# EAGLE design IMU_module (EAGLE 7.2.0)
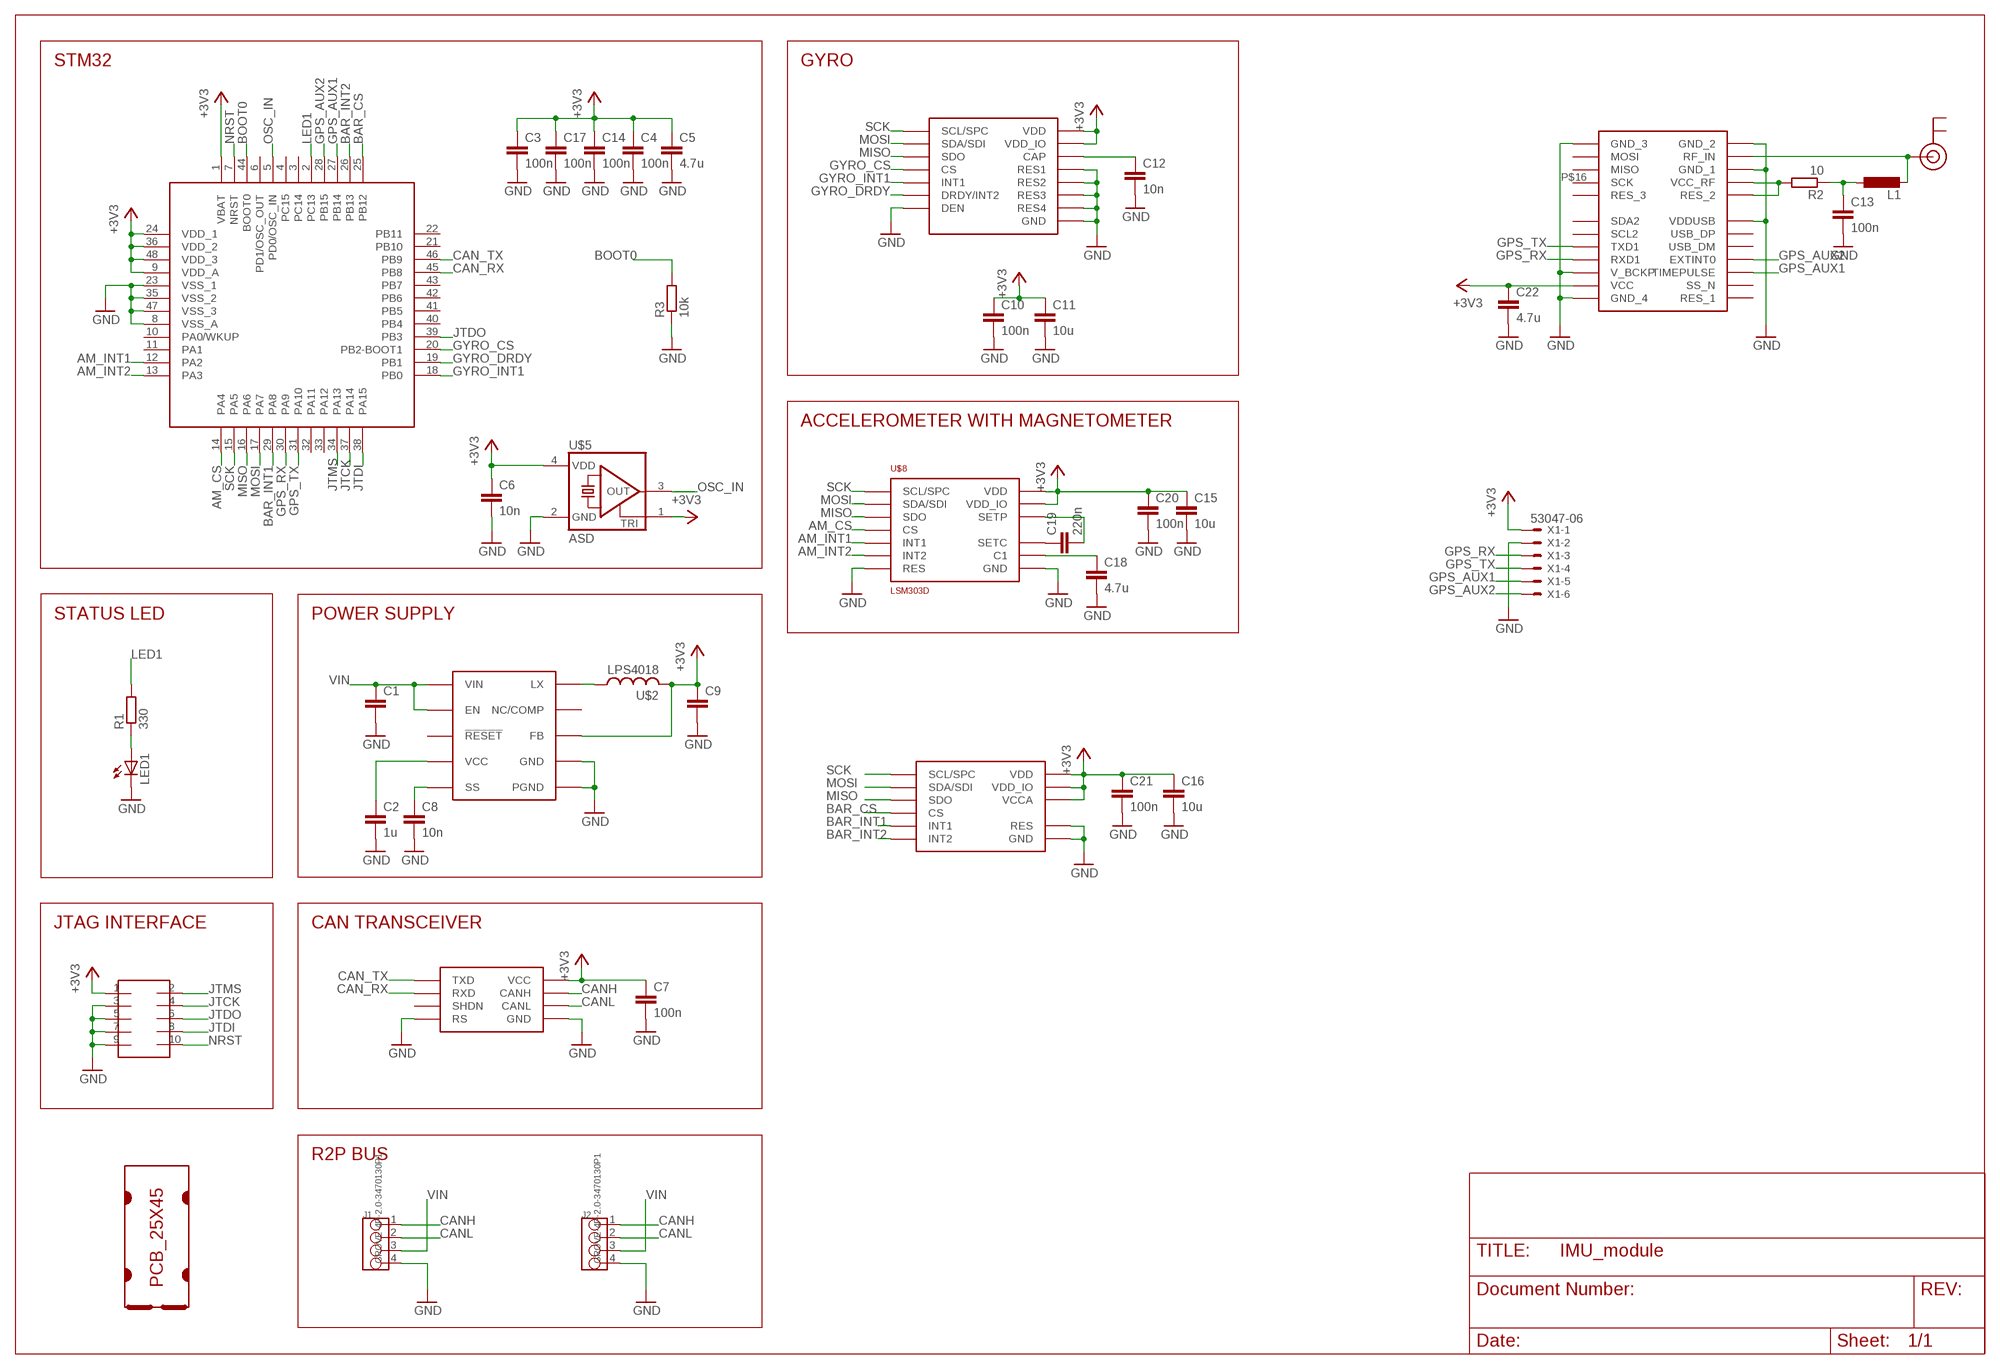
[diagram p0: schematic, sheet 1]

## Parts
C1  C-EUC1206  [C1206]
C2  1u  C-EUC0603  [C0603]
C3  100n  C-EUC0603  [C0603]
C4  100n  C-EUC0603  [C0603]
C5  4.7u  C-EUC0805  [C0805]
C6  10n  C-EUC0603  [C0603]
C7  100n  C-EUC0603  [C0603]
C8  10n  C-EUC0603  [C0603]
C9  C-EUC0805  [C0805]
C10  100n  C-EUC0603  [C0603]
C11  10u  C-EUC0805  [C0805]
C12  10n  C-EUC0603  [C0603]
C13  100n  C-EUC0603  [C0603]
C14  100n  C-EUC0603  [C0603]
C15  10u  C-EUC0805  [C0805]
C16  10u  C-EUC0805  [C0805]
C17  100n  C-EUC0603  [C0603]
C18  4.7u  C-EUC0805  [C0805]
C19  220n  C-EUC0603  [C0603]
C20  100n  C-EUC0603  [C0603]
C21  100n  C-EUC0603  [C0603]
C22  4.7u  C-EUC0805  [C0805]
J1  GROVE-4P-2.0-3470130P1  [4P-2.0]
J2  GROVE-4P-2.0-3470130P1  [4P-2.0]
L1  L-EUL2012C  [L2012C]
LED1  LEDCHIPLED_0805  [CHIPLED_0805]
R1  330  R-EU_R0603  [R0603]
R2  10  R-EU_R0603  [R0603]
R3  10k  R-EU_R0603  [R0603]
SOT1  MAX3051EKA  [SOT23-8L]
U$1  PCB_25X45  [25X45]
U$2  LPS4018  [LPS4018]
U$3  MAX17501  [TDFN-10]
U$4  FTSH-105TH  [FTSH-105-TH]
U$5  ASD  [2.5X2]
U$6  STM32F103CXTX  [LQFP48]
U$7  L3GD20H  [LGA16L]
U$8  LSM303D  [LGA16L]
U$9  LPS331AP  [LGA16L]
U$10  NEO-6  [NEO]
U$11  U.FL  [U.FL]
X1  53047-06  [53047-06]

## Nets
+3V3: C3.1 C4.1 C5.1 C6.1 C7.1 C9.1 C10.1 C11.1 C14.1 C15.1 C16.1 C17.1 C20.1 C21.1 C22.1 SOT1.3(VCC) U$2.P$2 U$3.P$5(FB) U$4.1 U$5.1(TRI) U$5.4(VDD) U$6.1(VBAT) U$6.9(VDD_A) U$6.24(VDD_1) U$6.36(VDD_2) U$6.48(VDD_3) U$7.P$1(VDD_IO) U$7.P$16(VDD) U$8.P$1(VDD_IO) U$8.P$14(VDD) U$9.P$1(VDD_IO) U$9.P$14(VDD) U$9.P$15(VCCA) U$10.P$23(VCC) X1.1
AM_CS: U$6.14(PA4) U$8.P$8(CS)
AM_INT1: U$6.12(PA2) U$8.P$11(INT1)
AM_INT2: U$6.13(PA3) U$8.P$9(INT2)
BAR_CS: U$6.25(PB12) U$9.P$8(CS)
BAR_INT1: U$6.29(PA8) U$9.P$11(INT1)
BAR_INT2: U$6.26(PB13) U$9.P$9(INT2)
BOOT0: R3.2 U$6.44(BOOT0)
CAN_RX: SOT1.4(RXD) U$6.45(PB8)
CAN_TX: SOT1.1(TXD) U$6.46(PB9)
CANH: J1.1 J2.1 SOT1.7(CANH)
CANL: J1.2 J2.2 SOT1.6(CANL)
GND: C1.2 C2.2 C3.2 C4.2 C5.2 C6.2 C7.2 C8.2 C9.2 C10.2 C11.2 C12.2 C13.2 C14.2 C15.2 C16.2 C17.2 C18.2 C20.2 C21.2 C22.2 J1.4 J2.4 LED1.C R3.1 SOT1.2(GND) SOT1.8(RS) U$3.P$1(PGND) U$3.P$9(GND) U$3.P$11(PGND) U$4.3 U$4.5 U$4.7 U$4.9 U$5.2(GND) U$6.8(VSS_A) U$6.23(VSS_1) U$6.35(VSS_2) U$6.47(VSS_3) U$7.P$8(DEN) U$7.P$9(RES1) U$7.P$10(RES2) U$7.P$11(RES3) U$7.P$12(GND) U$7.P$13(GND) U$7.P$15(RES4) U$8.P$5(GND) U$8.P$10(RES) U$8.P$12(GND) U$8.P$13(GND) U$8.P$16(GND) U$9.P$5(GND) U$9.P$10(RES) U$9.P$12(GND) U$9.P$13(GND) U$9.P$16(GND) U$10.P$7(VDDUSB) U$10.P$10(GND_1) U$10.P$12(GND_2) U$10.P$13(GND_3) U$10.P$22(V_BCKP) U$10.P$24(GND_4) X1.2
GPS_AUX1: U$6.27(PB14) U$10.P$3(TIMEPULSE) X1.5
GPS_AUX2: U$6.28(PB15) U$10.P$4(EXTINT0) X1.6
GPS_RX: U$6.30(PA9) U$10.P$21(RXD1) X1.3
GPS_TX: U$6.31(PA10) U$10.P$20(TXD1) X1.4
GYRO_CS: U$6.20(PB2-BOOT1) U$7.P$5(CS)
GYRO_DRDY: U$6.19(PB1) U$7.P$6(DRDY/INT2)
GYRO_INT1: U$6.18(PB0) U$7.P$7(INT1)
JTCK: U$4.4 U$6.37(PA14)
JTDI: U$4.8 U$6.38(PA15)
JTDO: U$4.6 U$6.39(PB3)
JTMS: U$4.2 U$6.34(PA13)
LED1: R1.2 U$6.2(PC13)
MISO: U$6.16(PA6) U$7.P$4(SDO) U$8.P$7(SDO) U$9.P$7(SDO)
MOSI: U$6.17(PA7) U$7.P$3(SDA/SDI) U$8.P$6(SDA/SDI) U$9.P$6(SDA/SDI)
N$1: U$2.P$1 U$3.P$10(LX)
N$3: C12.1 U$7.P$14(CAP)
N$4: LED1.A R1.1
N$5: C18.1 U$8.P$15(C1)
N$6: C19.1 U$8.P$2(SETC)
N$7: C2.1 U$3.P$4(VCC)
N$8: C8.1 U$3.P$6(SS)
N$9: C19.2 U$8.P$3(SETP)
N$10: L1.2 U$10.P$11(RF_IN) U$11.P$3(SIGNAL)
N$11: C13.1 L1.1 R2.1
N$12: R2.2 U$10.P$8(RES_2) U$10.P$9(VCC_RF)
NRST: U$4.10 U$6.7(NRST)
OSC_IN: U$5.3(OUT) U$6.5(PD0/OSC_IN)
SCK: U$6.15(PA5) U$7.P$2(SCL/SPC) U$8.P$4(SCL/SPC) U$9.P$4(SCL/SPC)
VIN: C1.1 J1.3 J2.3 U$3.P$2(VIN) U$3.P$3(EN)
Unconnected: SOT1.5(SHDN) U$3.P$7(NC/COMP) U$3.P$8(!RESET) U$6.3(PC14) U$6.4(PC15) U$6.6(PD1/OSC_OUT) U$6.10(PA0/WKUP) U$6.11(PA1) U$6.21(PB10) U$6.22(PB11) U$6.32(PA11) U$6.33(PA12) U$6.40(PB4) U$6.41(PB5) U$6.42(PB6) U$6.43(PB7) U$10.P$1(RES_1) U$10.P$2(SS_N) U$10.P$5(USB_DM) U$10.P$6(USB_DP) U$10.P$14(MOSI) U$10.P$15(MISO) U$10.P$16(SCK) U$10.P$17(RES_3) U$10.P$18(SDA2) U$10.P$19(SCL2) U$11.P$1(GND) U$11.P$2(GND)

## Notes on the sheet
- STM32 | GYRO
- ACCELEROMETER WITH MAGNETOMETER
- STATUS LED | POWER SUPPLY
- JTAG INTERFACE | CAN TRANSCEIVER
- R2P BUS

## Library data of the parts
C1-C22 = rcl:C-EU: CAPACITOR, European symbol
J1 J2 = OPL Eagle Library:GROVE-4P-2.0
L1 = rcl:L-EU: INDUCTOR, European symbol
LED1 = led:LED: LED OSRAM: - CHIPLED LG R971, LG N971, LY N971, LG Q971, LY Q971, LO R971, LY R971 LH N974, LH R974 LS Q976, LO Q976, LY Q976 LO Q996 - Hyper CHIPLED LW Q18S LB Q993, LB Q99A, LB R99A - SideLED LS A670, LO A670, LY A670, LG A670, LP A670 LB A673, LV A673, LT A673, LW A673 LH A674 LY A675 LS A676, LA A676, LO A676, LY A676, LW A676 LS A679, LY A679, LG A679 - Hyper Micro SIDELED® LS Y876, LA Y876, LO Y876, LY Y876 LT Y87S - SmartLED LW L88C, LW L88S LB L89C, LB L89S, LG L890 LS L89K, LO L89K, LY L89K LS L896, LA L896, LO L896, LY L896 - TOPLED LS T670, LO T670, LY T670, LG T670, LP T670 LSG T670, LSP T670, LSY T670, LOP T670, LYG T670 LG T671, LOG T671, LSG T671 LB T673, LV T673, LT T673, LW T673 LH T674 LS T676, LA T676, LO T676, LY T676, LB T676, LH T676, LSB T676, LW T676 LB T67C, LV T67C, LT T67C, LS T67K, LO T67K, LY T67K, LW E67C LS E67B, LA E67B, LO E67B, LY E67B, LB E67C, LV E67C, LT E67C LW T67C LS T679, LY T679, LG T679 LS T770, LO T770, LY T770, LG T770, LP T770 LB T773, LV T773, LT T773, LW T773 LH T774 LS E675, LA E675, LY E675, LS T675 LS T776, LA T776, LO T776, LY T776, LB T776 LHGB T686 LT T68C, LB T68C - Hyper Mini TOPLED® LB M676 - Mini TOPLED Santana® LG M470 LS M47K, LO M47K, LY M47K Source: http://www.osram.convergy.de LUXEON: - LUMILED® LXK2-PW12-R00, LXK2-PW12-S00, LXK2-PW14-U00, LXK2-PW14-V00 LXK2-PM12-R00, LXK2-PM12-S00, LXK2-PM14-U00 LXK2-PE12-Q00, LXK2-PE12-R00, LXK2-PE12-S00, LXK2-PE14-T00, LXK2-PE14-U00 LXK2-PB12-K00, LXK2-PB12-L00, LXK2-PB12-M00, LXK2-PB14-N00, LXK2-PB14-P00, LXK2-PB14-Q00 LXK2-PR12-L00, LXK2-PR12-M00, LXK2-PR14-Q00, LXK2-PR14-R00 LXK2-PD12-Q00, LXK2-PD12-R00, LXK2-PD12-S00 LXK2-PH12-R00, LXK2-PH12-S00 LXK2-PL12-P00, LXK2-PL12-Q00, LXK2-PL12-R00 Source: www.luxeon.com KINGBRIGHT: KA-3528ASYC Source: www.kingbright.com
R1-R3 = rcl:R-EU_: RESISTOR, European symbol
SOT1 = maxim:MAX3051
U$1 = r2p_pcb:PCB_25X45
U$2 = coilcraft:LPS4018
U$3 = maxim:MAX17501
U$4 = samtec:FTSH-105
U$5 = abracon:ASD
U$6 = st:STM32F103CX
U$7 = st:L3GD20H
U$8 = st:LSM303D
U$9 = st:LPS331AP
U$10 = u-blox:NEO-6
U$11 = SparkFun:U.FL
X1 = con-molex:53?-06: CONNECTOR wire to board 1.25 mm (.049 inch) pitch header; MPN: 53047-0610-C; OC_FARNELL: 9733078; OC_NEWARK: 03M2965

## Board
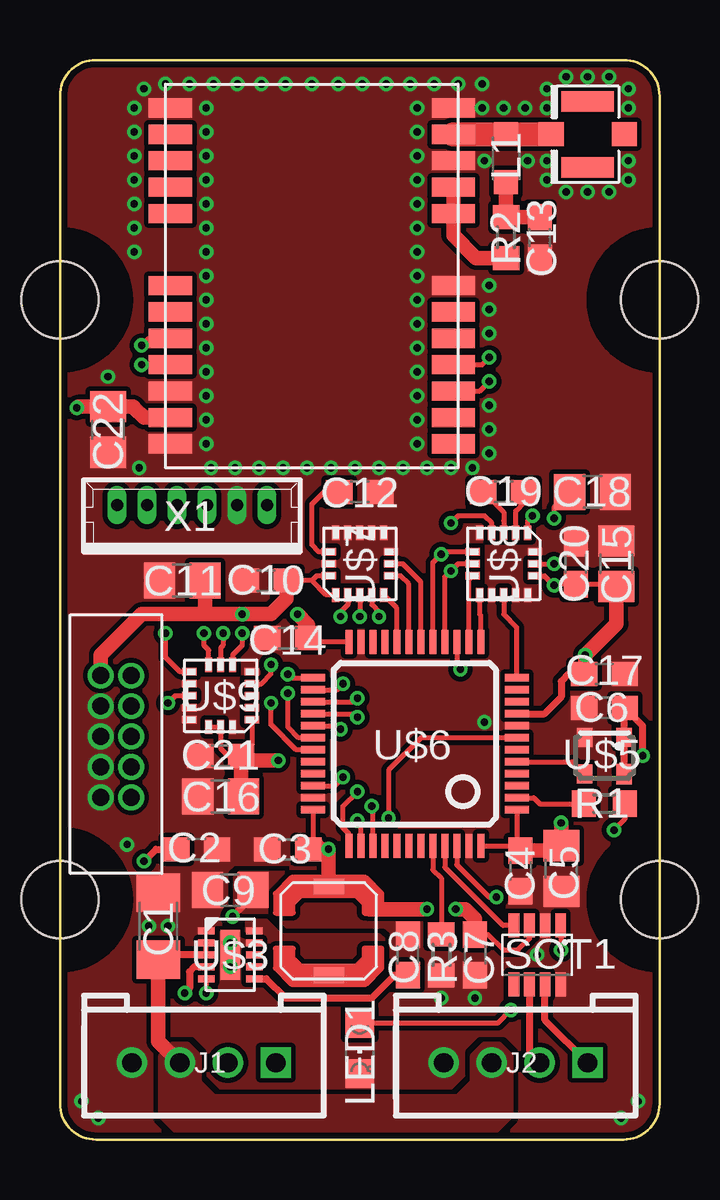
[diagram p1: board, top side]
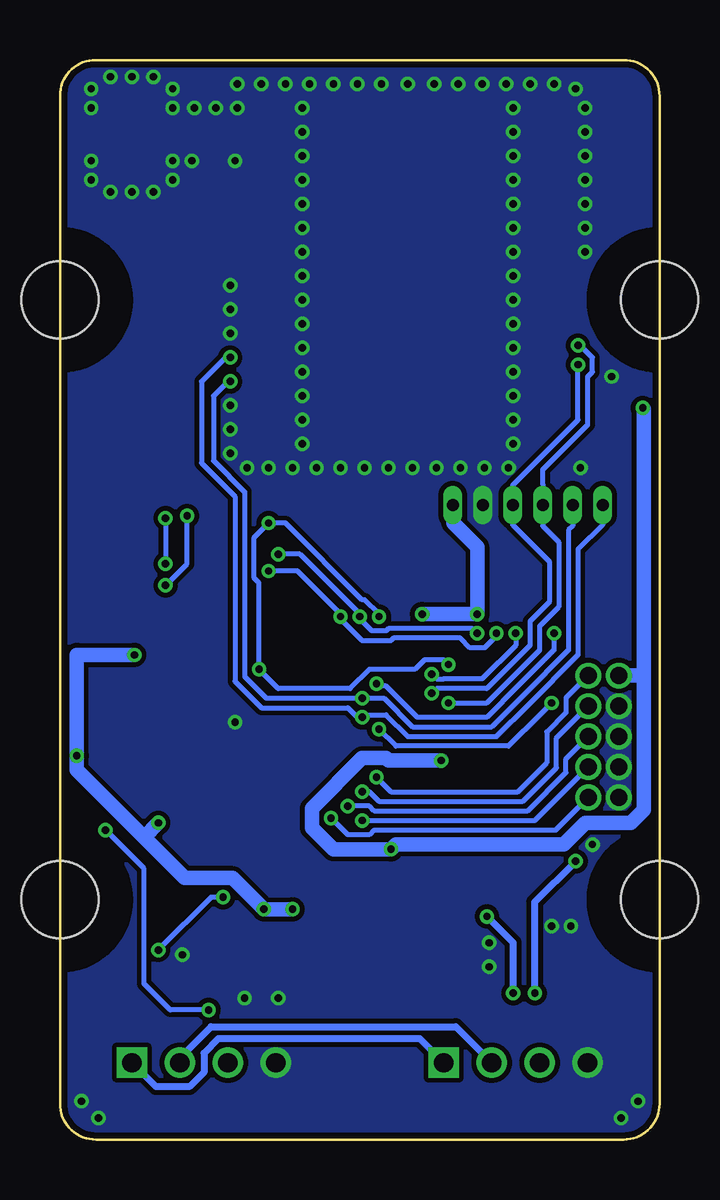
[diagram p2: board, bottom side, seen from below]

Size 25 x 45 mm. Coordinates in mm from the lower left corner, seen from the top.
Copper layers (1*16): Top 0.035mm / dielectric 1.5mm / Bottom 0.035mm
Design rules "test": minimum track width 0.2mm, minimum drill 0.3mm, track to track 0.2mm, track to pad 0.2mm, pad to pad 0.2mm, via to via 0.2mm, smd to smd 0mil, copper to edge 10mil, drill to drill 10mil, minimum pad ring 0.15mm, minimum via ring 0.15mm, stop-mask expansion 2mil, vias tented up to drill 100mil, thermal gap 10mil
tRestrict: 3 lines

### Footprints (pad centres in the part's own frame; a part is rotated, then mirrored left to right if it is on the bottom)
C1206 = smd 1.6 x 1.8: 1 -1.4,0; 2 1.4,0
C0603 = smd 1.1 x 1: 1 -0.85,0; 2 0.85,0
C0805 = smd 1.3 x 1.5: 1 -0.95,0; 2 0.95,0
4P-2.0 = drill 0.8 pad 1.27 square: 1 -3,0 | drill 0.8 pad 1.27: 2 -1,0; 3 1,0; 4 3,0
L2012C = smd 1 x 1: 1 -1,0; 2 1,0
CHIPLED_0805 = smd 1.2 x 1.2: A 0,-1.05; C 0,1.05
R0603 = smd 1 x 1.1: 1 -0.85,0; 2 0.85,0
SOT23-8L = smd 0.45 x 1: 1 -0.975,-1.225; 2 -0.325,-1.225; 3 0.325,-1.225; 4 0.975,-1.225; 5 0.975,1.225; 6 0.325,1.225; 7 -0.325,1.225; 8 -0.975,1.225
25X45 = hole 3.2: 0,10; 25,10; 0,35; 25,35
LPS4018 = smd 0.635 x 1.27: P$1 -1.85,0; P$2 1.85,0
TDFN-10 = smd 0.7 x 0.3: P$1 -1,1; P$2 -1,0.5; P$3 -1,0; P$4 -1,-0.5; P$5 -1,-1; P$6 1,-1; P$7 1,-0.5; P$8 1,0; P$9 1,0.5; P$10 1,1 | smd 0.8 x 2.08: P$11 0,0
FTSH-105-TH = drill 0.711 pad 1.016: 1 -2.54,0; 2 -2.54,1.27; 3 -1.27,0; 4 -1.27,1.27; 5 0,0; 6 0,1.27; 7 1.27,0; 8 1.27,1.27; 9 2.54,0; 10 2.54,1.27
2.5X2 = smd 0.65 x 0.8: 1 -0.825,-0.762; 2 0.825,-0.762; 3 0.825,0.762 | smd 0.65 x 0.85: 4 -0.825,0.762
LQFP48 = smd 1 x 0.3: 1 -4.25,2.75; 2 -4.25,2.25; 3 -4.25,1.75; 4 -4.25,1.25; 5 -4.25,0.75; 6 -4.25,0.25; 7 -4.25,-0.25; 8 -4.25,-0.75; 9 -4.25,-1.25; 10 -4.25,-1.75; 11 -4.25,-2.25; 12 -4.25,-2.75; 25 4.25,-2.75; 26 4.25,-2.25; 27 4.25,-1.75; 28 4.25,-1.25; 29 4.25,-0.75; 30 4.25,-0.25; 31 4.25,0.25; 32 4.25,0.75; 33 4.25,1.25; 34 4.25,1.75; 35 4.25,2.25; 36 4.25,2.75 | smd 0.3 x 1: 13 -2.75,-4.25; 14 -2.25,-4.25; 15 -1.75,-4.25; 16 -1.25,-4.25; 17 -0.75,-4.25; 18 -0.25,-4.25; 19 0.25,-4.25; 20 0.75,-4.25; 21 1.25,-4.25; 22 1.75,-4.25; 23 2.25,-4.25; 24 2.75,-4.25; 37 2.75,4.25; 38 2.25,4.25; 39 1.75,4.25; 40 1.25,4.25; 41 0.75,4.25; 42 0.25,4.25; 43 -0.25,4.25; 44 -0.75,4.25; 45 -1.25,4.25; 46 -1.75,4.25; 47 -2.25,4.25; 48 -2.75,4.25
LGA16L = smd 0.6 x 0.3: P$1 -1.3,1; P$2 -1.3,0.5; P$3 -1.3,0; P$4 -1.3,-0.5; P$5 -1.3,-1; P$9 1.3,-1; P$10 1.3,-0.5; P$11 1.3,0; P$12 1.3,0.5; P$13 1.3,1 | smd 0.3 x 0.6: P$6 -0.5,-1.3; P$7 0,-1.3; P$8 0.5,-1.3; P$14 0.5,1.3; P$15 0,1.3; P$16 -0.5,1.3
NEO = smd 1.8 x 0.8: P$1 5.9,0; P$2 5.9,1.1; P$3 5.9,2.2; P$4 5.9,3.3; P$5 5.9,4.4; P$6 5.9,5.5; P$7 5.9,6.6; P$8 5.9,9.6; P$9 5.9,10.7; P$10 5.9,11.8; P$11 5.9,12.9; P$12 5.9,14; P$13 -5.9,14; P$14 -5.9,12.9; P$15 -5.9,11.8; P$16 -5.9,10.7; P$17 -5.9,9.6; P$18 -5.9,6.6; P$19 -5.9,5.5; P$20 -5.9,4.4; P$21 -5.9,3.3; P$22 -5.9,2.2; P$23 -5.9,1.1; P$24 -5.9,0
U.FL = smd 2.2 x 0.85: P$1 0,1.375; P$2 0,-1.375 | smd 1.05 x 1: P$3 1.525,0; P$4 -1.525,0
53047-06 = drill 0.5 pad 0.698 long: 1 3.125,0.45; 2 1.875,0.45; 3 0.625,0.45; 4 -0.625,0.45; 5 -1.875,0.45; 6 -3.125,0.45

### Placement (x,y rotation side)
C1  4.1,8.9 90 top
C2  5.7,12.1 0 top
C3  9.5,12.1 180 top
C4  19.2,11.2 270 top
C5  20.9,11.3 270 top
C6  22.7,18 180 top
C7  17.3,7.7 270 top
C8  14.5,7.7 90 top
C9  7.1,10.4 180 top
C10  8.6,23.3 180 top
C11  5.1,23.3 180 top
C12  12.5,27 0 top
C13  20,37.6 270 top
C14  9.5,20.9 180 top
C15  23.2,24 90 top
C16  6.7,14.3 180 top
C17  22.7,19.4 0 top
C18  22.2,27 0 top
C19  18.5,27 180 top
C20  21.5,24 90 top
C21  6.7,16 180 top
C22  2,29.6 270 top
J1  6,3.2 180 top
J2  19,3.2 180 top
L1  18.6,40.9 90 top
LED1  12.5,3.8 180 top
R1  22.7,14 180 top
R2  18.6,37.6 270 top
R3  15.9,7.7 90 top
SOT1  19.9,7.7 180 top
U$1  0,0 0 top
U$2  11.2,8.7 90 top
U$3  7.1,7.7 0 top
U$4  1.7,16.8 270 top
U$5  22.7,16 180 top
U$6  14.8,16.5 180 top
U$7  12.5,24 90 top
U$8  18.5,24 270 top
U$9  6.7,18.5 180 top
U$10  10.5,29 0 top
U$11  22,41.9 180 top
X1  5.5,26 0 top

### Tracks (layer width: path | path; a pad name or v marks a point on that pad's centre or on a via)
+3V3  (via drill 0.3)
  Top 0.2: U$3.P$5 v6.1,6.1 | C7.1 17.85,8.55 18.5,7.9 19.1,7.9 19.57,8.38 SOT1.3 | U$6.36 10.55,12.3 C3.1 | U$6.48 19,12.25 C4.1 19.05,12.2 U$6.1 | U$6.24 10.5,20.75 10.4,20.85 | C15.1 23.1,23.15 C20.1 20.65,23.15 v20.6,23.1 20.2,23.5 U$8.P$14 | U$8.P$1 19.5,25.8 v19.7,26 | U$9.P$14 U$9.P$15 6.7,16.3 7,16 C21.1 8,16.45 U$9.P$1 | U$7.P$16 10.7,23.5 10.5,23.3 | 10.5,23.3 C10.1 | U$7.P$1 11.1,22.7 10.5,23.3
  Top 0.3: 8.05,10.55 8.05,10.75 7.95,10.75 | U$6.9 20.2,17.75 20.9,18.45 20.9,19.1 21.2,19.4 C17.1 | C6.1 23.52,17.98 | v24.3,16 24.3,17.25 C6.1 | v7.2,9.3 8.05,10.15 C9.1 | U$5.4 U$5.1 23.52,17.98 | 23.52,17.98 C6.1
  Top 0.6: U$2.P$2 v11.2,12.1 C3.1 | 10.55,12.3 10.7,12.3 | C4.1 20.7,12.05 C5.1 20.9,13.1 v20.9,13.2 | 21.8,19.45 C17.1 21.9,19.45 v21.9,20.2 23.2,21.5 C15.1 | v15.3,9.6 12.9,9.6 | 10.4,20.85 C14.1 10.35,21.45 v9.9,21.9 | C10.1 9.45,22.55 8.8,21.9 v7.6,21.9 5.9,21.9 | U$10.P$23 3.5,30.1 3.1,30.5 3.05,30.55 C22.1 0.75,30.55 v0.7,30.5 | v16.5,9.6 16.9,9.6 17.3,9.2 C7.1 | 5.9,21.9 3.4,21.9 1.7,20.2 U$4.1 | C11.1 6.05,22.05 5.9,21.9 | v9.1,15.8 7.75,15.8 C21.1 7.55,14.4 C16.1
  Bottom 0.2: v20.6,23.1 19.7,24 v19.7,26
  Bottom 0.3: v6.1,6.1 6.1,8.2 v7.2,9.3
  Bottom 0.6: v15.3,9.6 v16.5,9.6 17.8,10.9 19.8,10.9 21.5,12.6 | v20.9,13.2 21.5,12.6 | 21.5,12.6 24.3,15.4 v24.3,16 24.3,20.2 v21.9,20.2 | v9.1,15.8 11.3,15.8 11.4,15.9 12.4,15.9 14.5,13.8 14.5,13 13.6,12.1 v11.2,12.1 11,12.3 4,12.3 3.1,13.2 1.2,13.2 0.65,13.75 0.65,19.5 | 0.65,19.5 0.65,30.45 v0.7,30.5 | U$4.1 0.81,19.34 0.65,19.5 | X1.1 8.6,26.43 8.6,25.7 7.6,24.7 v7.6,21.9 v9.9,21.9
  pour Top (rank 5, no thermals): 13.3,8.9 13.5,9.1 13.5,10.3 12.8,11 9.5,11 9.4,11.1 7.5,11.1 7.3,10.9 7.3,9.8 8.3,8.9
AM_CS
  Top 0.2: 17.1,23.5 U$8.P$8 17.05,23.35 U$6.14
AM_INT1
  Top 0.2: U$8.P$11 18.5,21.9 19.05,21.35 U$6.12
AM_INT2
  Top 0.2: U$6.13 17.55,21.85 17.5,21.9 U$8.P$9
BAR_CS  (via drill 0.3)
  Top 0.2: U$9.P$8 6.2,20.4 6,20.6 v6,21.1 | v9.5,19.4 9.65,19.25 U$6.25
  Bottom 0.2: v6,21.1 6,20.6 7.4,19.2 9,19.2 9.3,19.2 v9.5,19.4
BAR_INT1  (via drill 0.3)
  Top 0.2: U$9.P$11 4.8,18.5 v4.5,18.2 | U$6.29 11.55,17.25 v11.7,17.1
  Bottom 0.2: v4.5,18.2 5,17.7 6.3,16.4 11,16.4 v11.7,17.1
BAR_INT2  (via drill 0.3)
  Top 0.2: U$6.26 11.55,18.75 v11.8,19 | U$9.P$9 5,19.5 4.4,20.1 v4.4,21.1
  Bottom 0.2: v4.4,21.1 4.4,20.4 5.9,18.9 7.2,17.6 10.1,17.6 11.4,18.9 11.7,18.9 v11.8,19
BOOT0
  Top 0.2: U$6.44 15.55,11.25 15.9,10.9 R3.2
CAN_RX
  Top 0.2: U$6.45 16.05,11.35 18.4,9 18.48,8.93 SOT1.4
CAN_TX  (via drill 0.3)
  Top 0.2: U$6.46 16.55,11.45 17.9,10.1 v18.2,10.1 | SOT1.1 20.88,7.92 v20.9,7.9
  Bottom 0.2: v18.2,10.1 18.7,10.1 v20.9,7.9
CANH
  Top 0.3: J2.1 20.23,4.97 SOT1.7
  Bottom 0.3: J1.1 10,4.2 18.4,4.2 19,3.6 19,2.8 19.6,2.2 21,2.2 J2.1
CANL
  Top 0.3: 19.57,3.62 J2.2 19.57,3.62 | SOT1.6 19.57,3.62
  Bottom 0.3: J1.2 8.5,4.7 18.7,4.7 20,3.4 J2.2
GND  (via drill 0.3)
  other vias: 7.1,8.2 7.1,7.2 4.5,8.9 3.7,8.9 15.9,5.9 17.3,5.9 19.9,7.7 24.1,1.6 23.4,0.9 1.6,0.9 0.9,1.6 17.7,17.4 17.6,43 18.5,43 20.3,43 22,39.5 17.7,40.8 20.3,43.8 21.1,44.3 22,44.3 22.9,44.3 23.7,43.8 23.7,43 19.4,43 20.3,40 20.3,40.8 22.9,39.5 21.1,39.5 23.7,40.8 23.7,40 19.5,40.8 16.6,44 15.6,44 14.6,44 13.6,44 12.6,44 11.6,44 10.5,44 9.4,44 8.4,44 7.4,44 6.4,44 5.4,44 4.4,44 3.5,43.8 3.1,43 3.1,42 3.1,41 3.1,40 3.1,39 3.1,38 3.1,37 17.6,44 17.9,35.6 17.9,34.6 17.9,33.6 17.9,30.6 17.9,29.6 17.9,28.6 17.2,28 16.3,28 15.3,28 14.3,28 13.3,28 12.3,28 11.3,28 10.3,28 9.3,28 8.3,28 7.3,28 6.3,28 6.1,29 6.1,30 6.1,31 6.1,32 6.1,33 6.1,34 6.1,35 6.1,36 6.1,37 6.1,38 6.1,39 6.1,40 6.1,41 6.1,42 6.1,43 14.9,43 14.9,42 14.9,41 14.9,40 14.9,39 14.9,38 14.9,37 14.9,36 14.9,35 14.9,34 14.9,33 14.9,32 14.9,31 14.9,30 14.9,29 3.3,28 2,31.8 2.8,12.3
  pour Bottom (no thermals): 0,0 25,0 25,45 0,45
  pour Top (rank 6, no thermals): 0,0 25,0 25,45 0,45
GPS_AUX1  (via drill 0.3)
  Top 0.2: U$6.27 12.25,18.25 v12.4,18.4 | U$10.P$3 17.5,31.2 v17.9,31.6
  Bottom 0.2: X1.5 3.62,25.57 3.8,25.4 3.8,20.4 5.7,18.5 7,17.2 10.3,17.2 11.5,18.4 v12.4,18.4 16.4,18.4 17.3,19.3 17.3,27 18.6,28.3 18.6,31 18,31.6 v17.9,31.6
GPS_AUX2  (via drill 0.3)
  Top 0.2: U$6.28 12.25,17.75 v12.4,17.6 | U$10.P$4 17.6,32.3 v17.9,32.6
  Bottom 0.2: X1.6 2.38,25.62 3.4,24.6 3.4,20.2 5.5,18.1 6.8,16.8 10.5,16.8 11.4,17.7 12.3,17.7 v12.4,17.6 12.6,17.6 13,18 16.6,18 17.7,19.1 17.7,26.8 19.1,28.2 19.1,31.6 18.1,32.6 v17.9,32.6
GPS_RX  (via drill 0.3)
  Top 0.2: U$10.P$21 v3.4,32.3 | U$6.30 9.95,16.75 9.5,17.2 v9.5,18.6
  Bottom 0.2: v3.4,32.3 3.4,30 6.12,27.27 X1.3 6.12,25.62 4.6,24.1 4.6,22.4 5.4,21.6 5.4,20.6 7.2,18.8 9.3,18.8 v9.5,18.6
GPS_TX  (via drill 0.3)
  Top 0.2: U$6.31 9.85,16.25 8.8,17.3 v8.8,18.2 | U$10.P$20 3.7,33.4 v3.4,33.1
  Bottom 0.2: v3.4,33.1 3.3,33.1 2.8,32.6 2.8,32 3,31.8 3,29.8 4.88,27.93 4.88,27.32 X1.4 4.88,25.57 4.2,24.9 4.2,22.2 5,21.4 5,20.4 7.2,18.2 v8.8,18.2
GYRO_CS
  Top 0.2: U$6.20 14.05,22.15 U$7.P$5
GYRO_DRDY
  Top 0.2: U$6.19 14.55,23.15 14.2,23.5 U$7.P$6
GYRO_INT1
  Top 0.2: U$6.18 15.05,23.25 14.3,24 U$7.P$7
JTCK  (via drill 0.3)
  Top 0.2: U$6.37 12.05,12.75 11.8,13 11.8,13.9 v12.4,14.5
  Bottom 0.2: v12.4,14.5 12.1,14.5 11.7,14.1 5.7,14.1 4.3,15.5 4.3,16.74 U$4.4
JTDI  (via drill 0.3)
  Top 0.2: U$6.38 12.55,13.15 v12.4,13.3
  Bottom 0.2: v12.4,13.3 5.2,13.3 U$4.8
JTDO  (via drill 0.3)
  Top 0.2: U$6.39 13.05,13.85 v13,13.9
  Bottom 0.2: v13,13.9 12.1,13.9 11.9,13.7 5.5,13.7 3.9,15.3 3.9,15.87 U$4.6
JTMS  (via drill 0.3)
  Top 0.2: U$6.34 11.45,14.75 v11.8,15.1
  Bottom 0.2: v11.8,15.1 11.2,14.5 5.9,14.5 4.7,15.7 4.7,17 3.9,17.8 3.9,18.41 U$4.2
LED1
  Top 0.2: U$6.2 19.75,14.25 20,14 R1.2
MISO  (via drill 0.3)
  Top 0.2: U$7.P$4 13,22.3 13.3,22 v13.3,21.8 | U$8.P$7 16.6,24 v16.3,23.7 16.05,23.45 U$6.16 | v6.8,21.1 6.8,20.6 6.7,20.5 U$9.P$7
  Bottom 0.2: v16.3,23.7 15.1,23.7 13.3,21.9 v13.3,21.8 13.3,21.7 12.4,20.8 11.2,20.8 11.1,20.9 8.3,20.9 7.9,20.5 7.3,20.5 6.8,21 v6.8,21.1
MOSI  (via drill 0.3)
  Top 0.2: U$7.P$3 v12.5,21.8 | U$6.17 15.55,24.05 v15.9,24.4 16,24.5 U$8.P$6 | v7.6,21.1 7.6,20.6 7.2,20.2 U$9.P$6
  Bottom 0.2: v15.9,24.4 15,24.4 12.5,21.9 v12.5,21.8 12.5,21.7 12,21.2 11.4,21.2 11.3,21.3 7.8,21.3 v7.6,21.1
N$1
  pour Top (no thermals): 7.8,8.7 8.2,8.7 8.5,8.2 8.5,7.5 9.6,6.4 12.8,6.4 13.5,7.1 13.5,8.3 13.3,8.5 9.2,8.5 8.6,9.1 7.8,9.1
N$3
  Top 0.2: U$7.P$14 10.8,24.5 10.5,24.8 10.5,26.5 11,27 C12.1
N$4  (via drill 0.3)
  Top 0.2: R1.1 23.55,13.35 v23.1,12.9 | v18.8,5.4 18.25,4.85 LED1.A
  Bottom 0.2: v18.8,5.4 20.4,5.4 21.5,6.5 21.5,11.3 v23.1,12.9
N$5  (via drill 0.3)
  Top 0.2: U$8.P$15 v20.6,24 | C18.1 20.6,26.35 v20.6,25.9
  Bottom 0.2: v20.6,25.9 v20.6,24
N$6
  Top 0.2: U$8.P$2 19,26.2 19.35,26.55 C19.1
N$7  (via drill 0.3)
  Top 0.3: U$3.P$4 5.6,7.2 5.4,7 5.4,6.3 v5.2,6.1 | v3.5,11.6 4,12.1 C2.1
  Bottom 0.3: v5.2,6.1 5.2,9.9 v3.5,11.6
N$8
  Top 0.3: U$3.P$6 8.6,6.7 9.4,5.9 13,5.9 13.95,6.85 C8.1
N$9
  Top 0.2: U$8.P$3 18.5,25.8 18.5,26.15 C19.2
N$10
  Top 0.2: L1.2 18.5,41.9
  Top 1: U$10.P$11 18.5,41.9 L1.2 U$11.P$3
N$11
  Top 0.6: C13.1 R2.1 L1.1
N$12
  Top 0.6: U$10.P$9 U$10.P$8 16.4,37.7 17.35,36.75 R2.2
NRST  (via drill 0.3)
  Top 0.2: U$6.7 15.05,16.75 13.7,15.4 v13.7,13.4
  Bottom 0.2: v13.7,13.4 13,12.7 12.7,12.7 12.1,12.7 11.9,12.9 4.33,12.9 U$4.10
OSC_IN
  Top 0.2: U$6.5 21.36,15.75 U$5.3
SCK  (via drill 0.3)
  Top 0.2: U$8.P$4 18,25.7 17.7,26 16.6,26 v16.3,25.7 | U$7.P$2 12,22.3 11.7,22 v11.7,21.8 | U$6.15 16.55,19.75 v16.7,19.6 | U$9.P$4 8.4,19 8.8,19.4 v8.8,19.8
  Bottom 0.2: v8.8,19.8 9,20 9.8,20 10.2,19.6 12.1,19.6 12.9,18.8 15.9,18.8 v16.7,19.6 16.7,23.2 16.9,23.4 16.9,25.1 v16.3,25.7 15.6,25.7 12.4,22.5 12.3,22.5 11.7,21.9 v11.7,21.8
VIN
  Top 0.2: U$3.P$3 U$3.P$2
  Top 0.3: U$3.P$3 4.3,7.7 C1.1
  Top 0.6: C1.1 4.1,4.1 J1.3
  pour Top (no thermals): 4.7,4 5.3,4 5.8,3.5 5.8,2.4 6.4,1.8 16.6,1.8 17.2,2.4 17.2,3.5 17.7,4 18.3,4 18.8,3.5 18.8,1 17.8,0 5.2,0 4.2,1 4.2,3.5

### Text on the board
Document: x | Y | Z
200bmp: IMU module / v1.1 (2014/12)